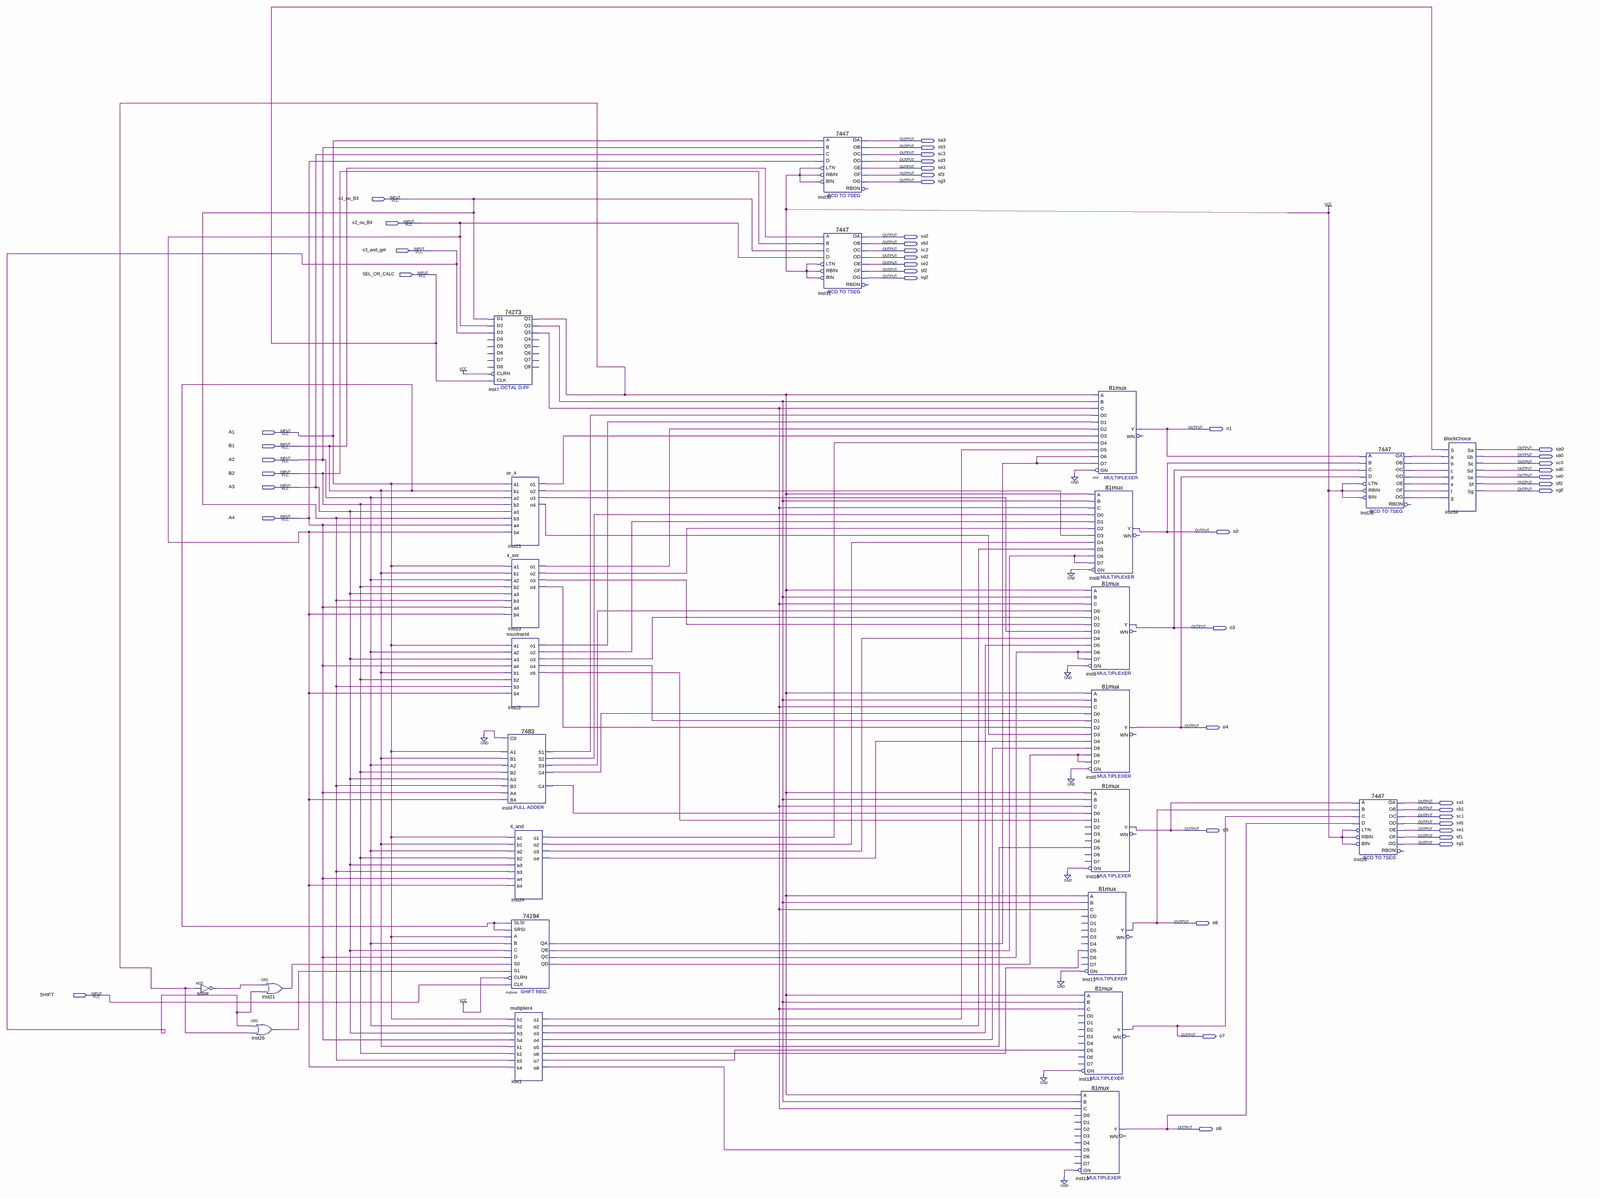
[diagram p0: schematic sheet, whole]
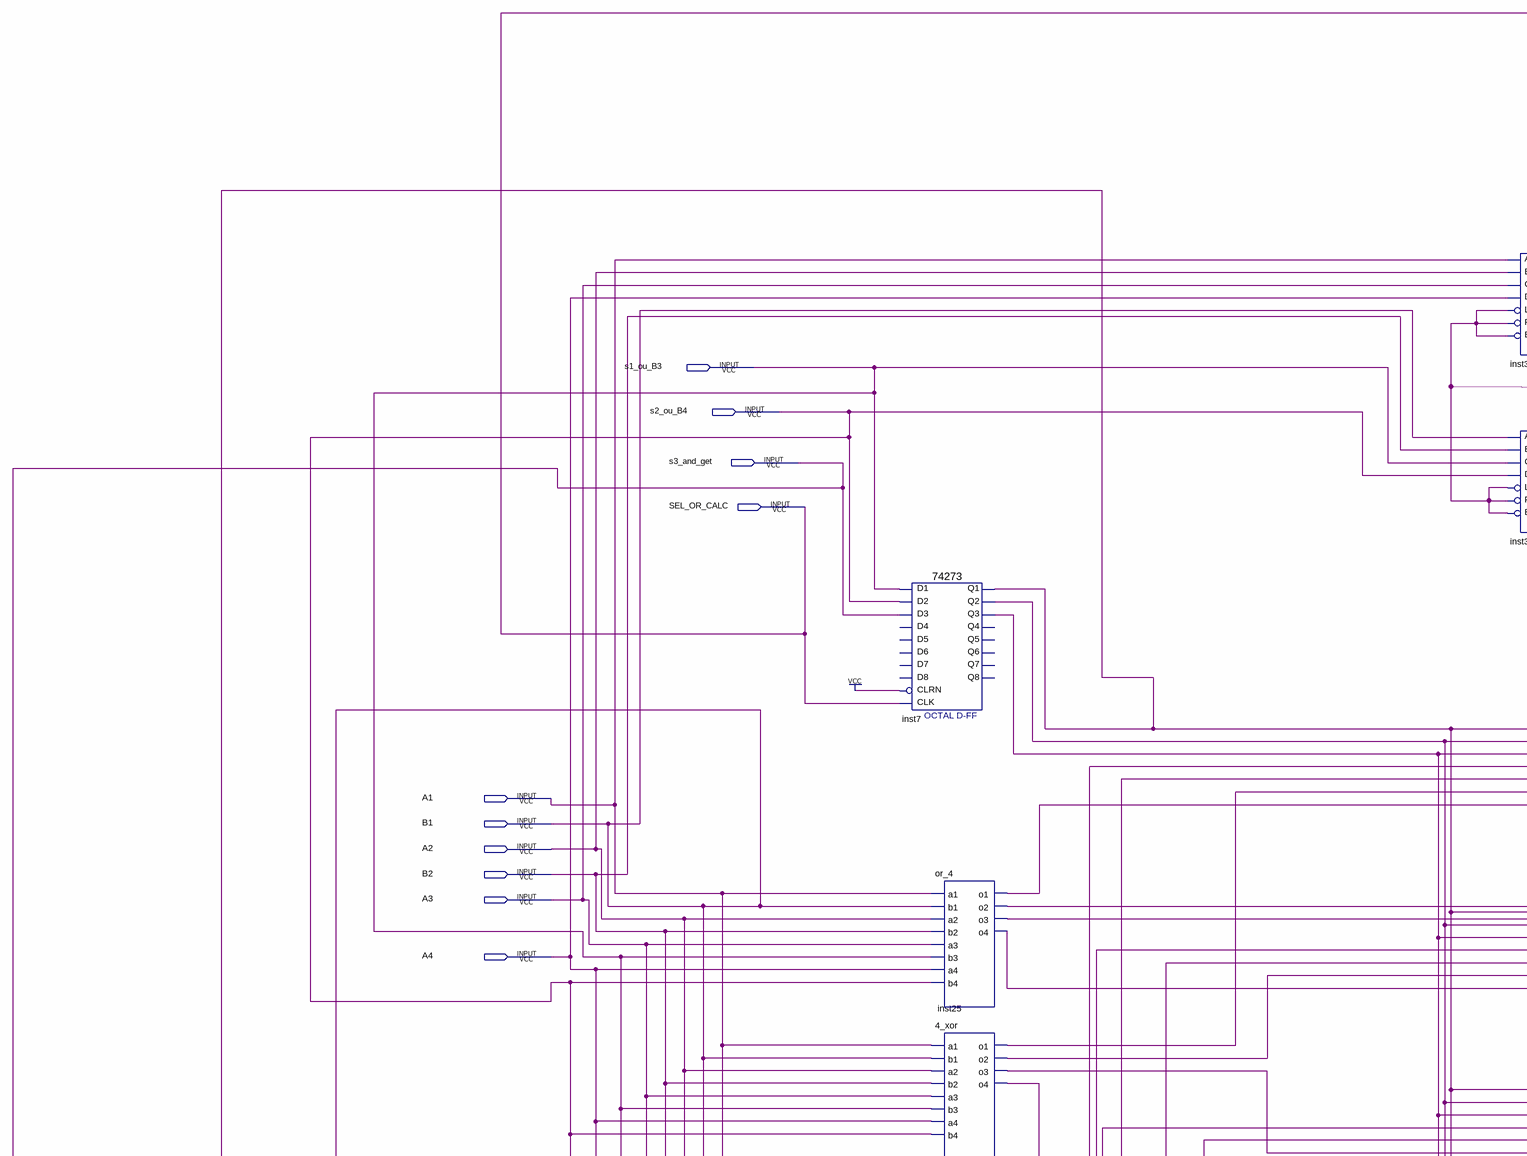
[diagram p1: schematic sheet, upper left part]
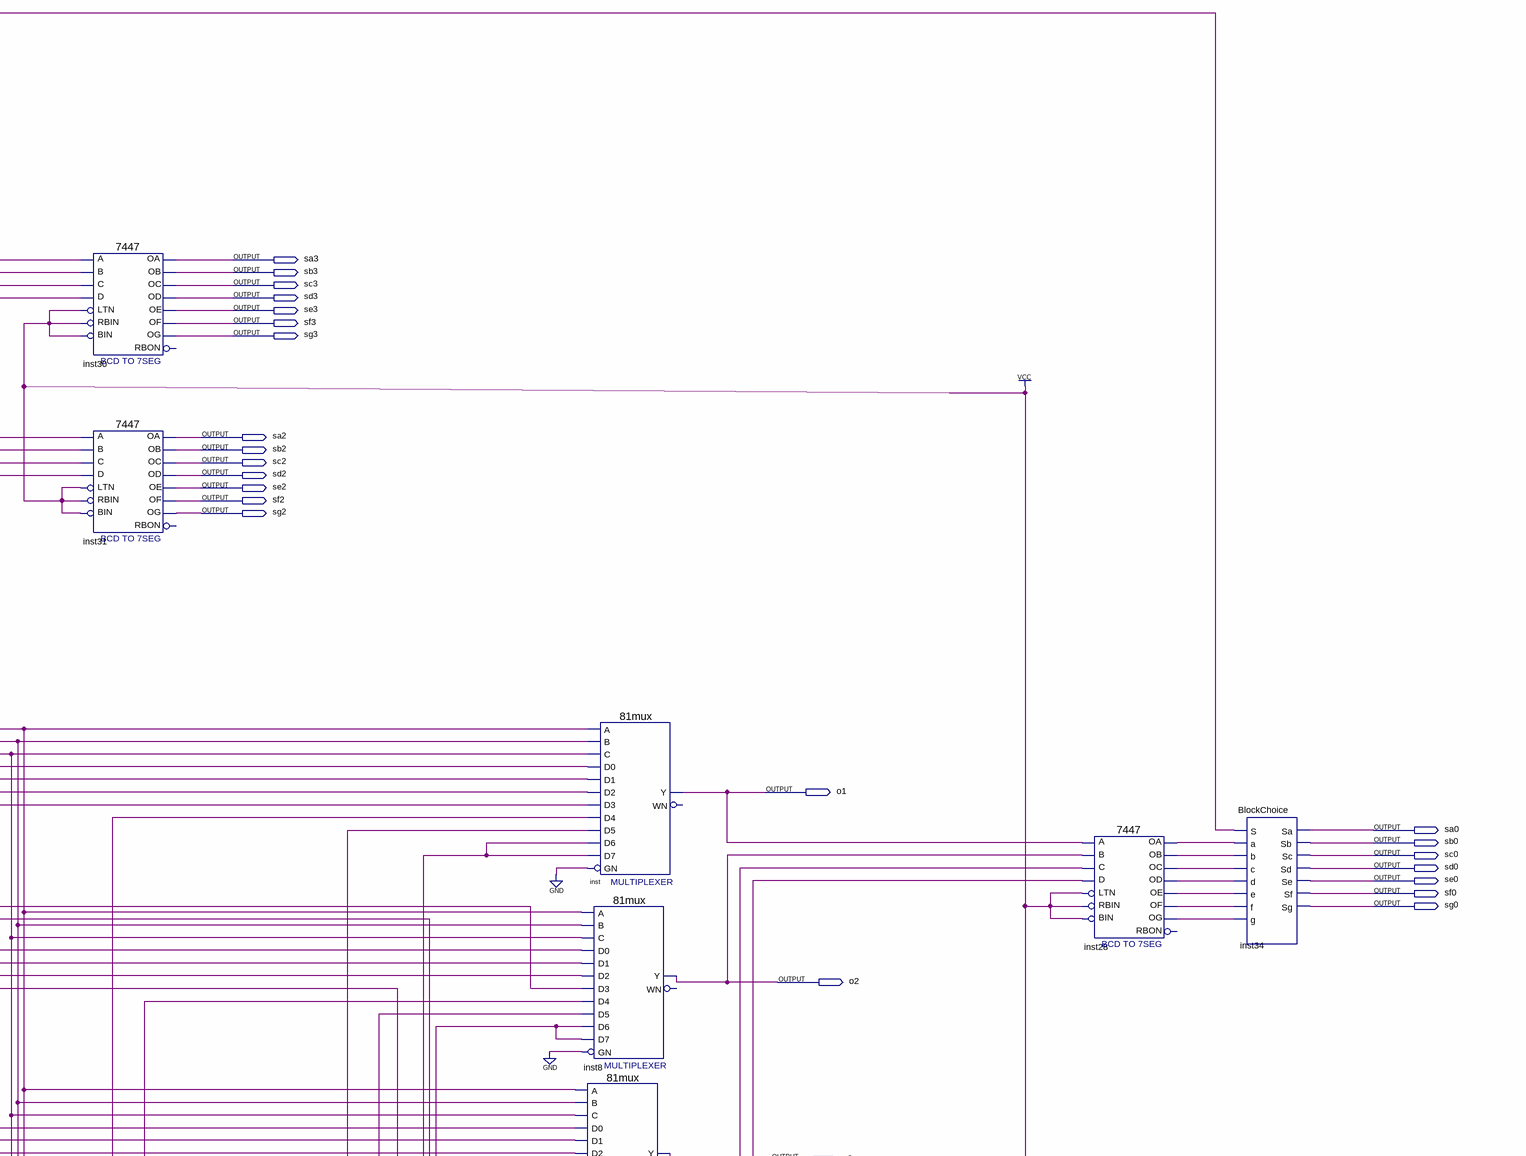
[diagram p2: schematic sheet, upper right part]
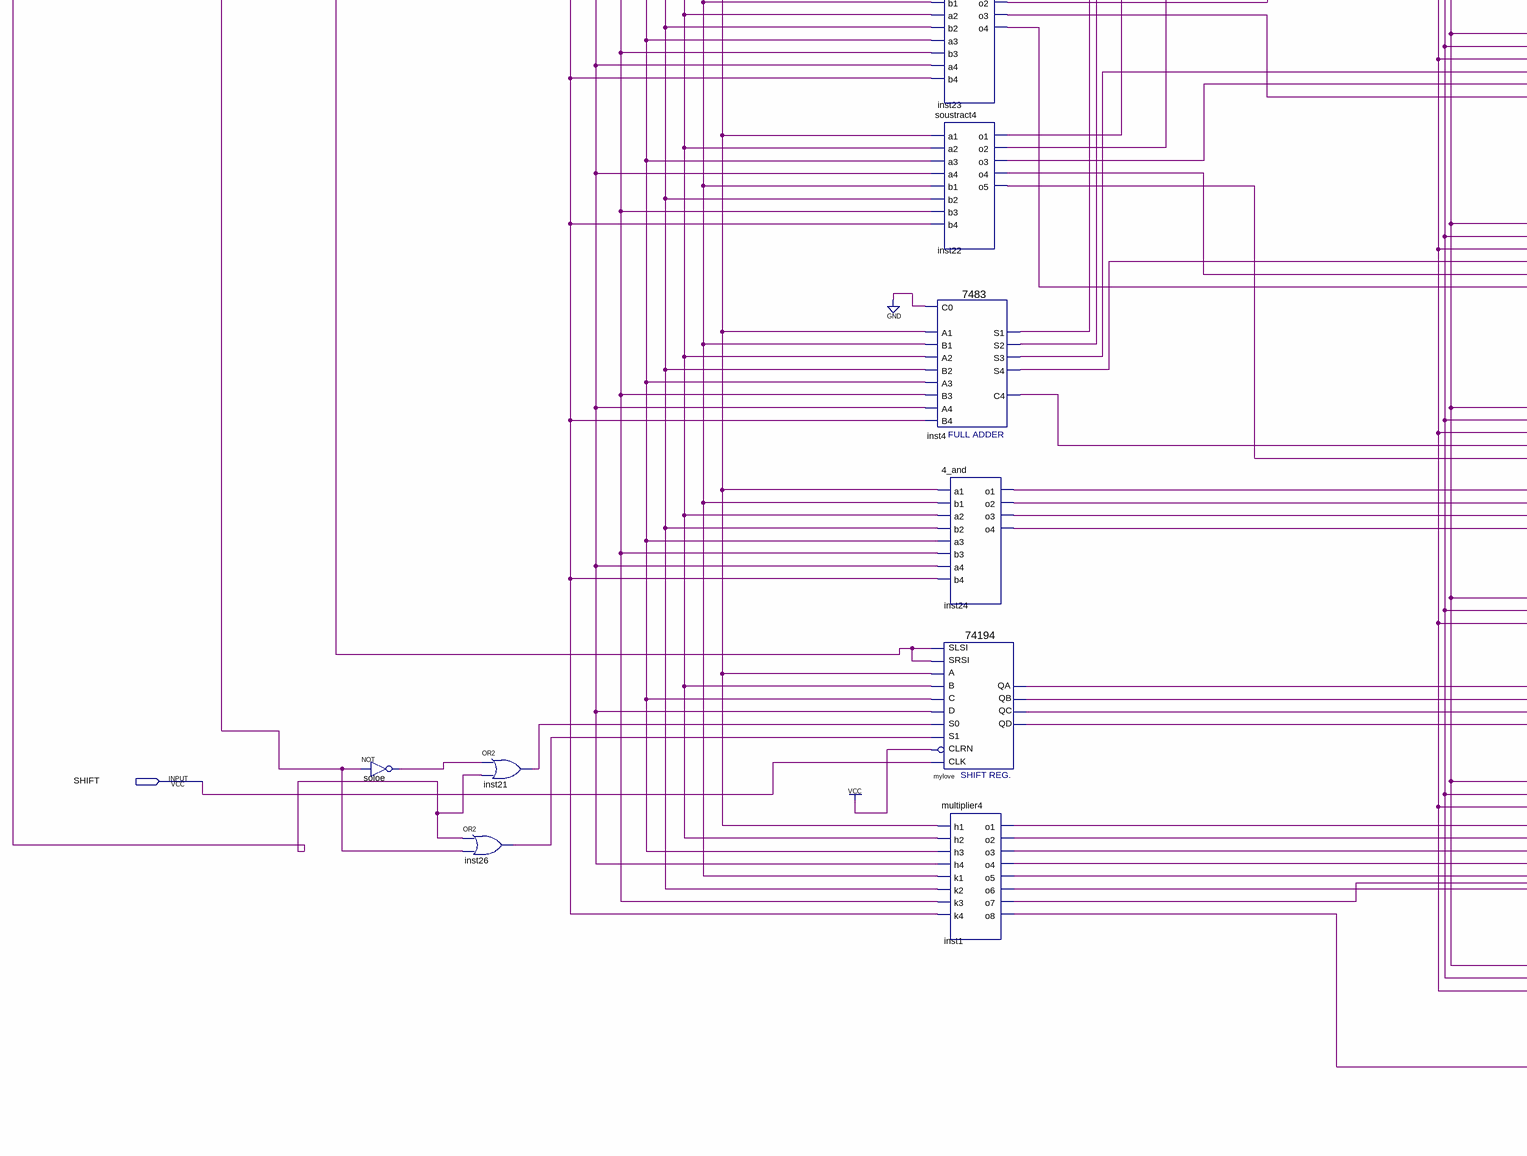
[diagram p3: schematic sheet, lower left part]
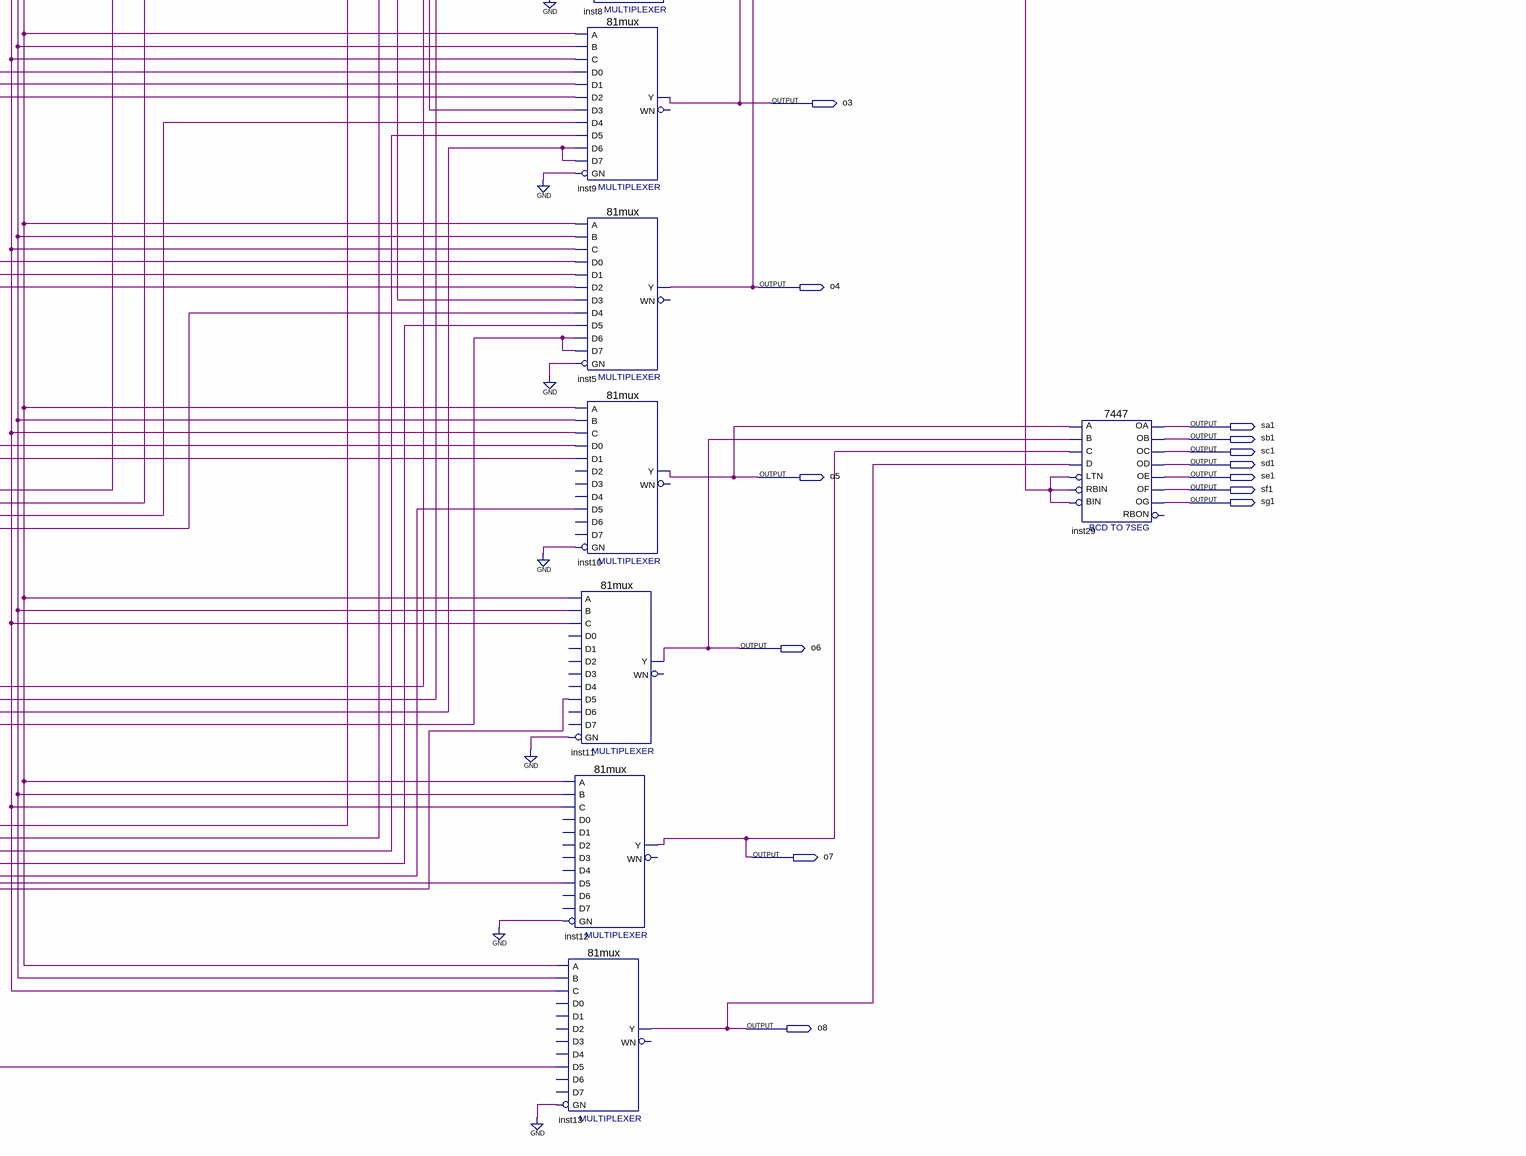
[diagram p4: schematic sheet, lower right part]
// Quartus schematic unitarithlogic.bdf as structural Verilog: 24 symbols, 47 pins
module unitarithlogic (
  input  s1_ou_B3,
  input  s2_ou_B4,
  input  s3_and_get,
  input  SEL_OR_CALC,
  input  A1,
  input  B1,
  input  A2,
  input  B2,
  input  A3,
  input  A4,
  input  SHIFT,
  output sa3,
  output sb3,
  output sc3,
  output sd3,
  output se3,
  output sf3,
  output sg3,
  output sa2,
  output sb2,
  output sc2,
  output sd2,
  output se2,
  output sf2,
  output sg2,
  output o1,
  output sa0,
  output sb0,
  output sc0,
  output sd0,
  output se0,
  output sf0,
  output sg0,
  output o2,
  output o3,
  output o4,
  output sa1,
  output sb1,
  output sc1,
  output sd1,
  output o5,
  output se1,
  output sf1,
  output sg1,
  output o6,
  output o7,
  output o8
);

  wire inst1_o1, inst1_o2, inst1_o3, inst1_o4, inst1_o5, inst1_o6, inst1_o7, inst1_o8, inst4_c4, inst4_s1,
       inst4_s2, inst4_s3, inst4_s4, inst7_q1, inst7_q2, inst7_q3, inst21_out, inst22_o1, inst22_o2,
       inst22_o3, inst22_o4, inst22_o5, inst23_o1, inst23_o2, inst23_o3, inst23_o4, inst24_o1, inst24_o2,
       inst24_o3, inst24_o4, inst25_o1, inst25_o2, inst25_o3, inst25_o4, inst26_out, inst28_oa, inst28_ob,
       inst28_oc, inst28_od, inst28_oe, inst28_of, inst28_og, mylove_qa, mylove_qb, mylove_qc, mylove_qd,
       soloe_out;

  not soloe (soloe_out, inst7_q1);
  or inst26 (inst26_out, s3_and_get, inst7_q1);
  or inst21 (inst21_out, soloe_out, s3_and_get);
  \74273  inst7 (
    .D2(s2_ou_B4), .D3(s3_and_get), .D1(s1_ou_B3), .CLK(SEL_OR_CALC), .CLRN(1'b1), .Q1(inst7_q1),
    .Q2(inst7_q2), .Q3(inst7_q3));  // open: D4, D7, D6, D5, D8, Q4, Q6, Q5, Q7, Q8
  or_4 inst25 (
    .a1(A1), .b1(B1), .a2(A2), .b2(B2), .a3(A3), .b3(s1_ou_B3), .a4(A4), .b4(s2_ou_B4), .o1(inst25_o1),
    .o2(inst25_o2), .o3(inst25_o3), .o4(inst25_o4));
  \4_xor  inst23 (
    .a1(A1), .b1(B1), .a2(A2), .b2(B2), .a3(A3), .b3(s1_ou_B3), .a4(A4), .b4(s2_ou_B4), .o1(inst23_o1),
    .o2(inst23_o2), .o3(inst23_o3), .o4(inst23_o4));
  soustract4 inst22 (
    .a1(A1), .a2(A2), .a3(A3), .a4(A4), .b1(B1), .b2(B2), .b3(s1_ou_B3), .b4(s2_ou_B4), .o1(inst22_o1),
    .o2(inst22_o2), .o3(inst22_o3), .o4(inst22_o4), .o5(inst22_o5));
  \7483  inst4 (
    .B4(s2_ou_B4), .C0(1'b0), .A1(A1), .A2(A2), .B1(B1), .B2(B2), .A3(A3), .B3(s1_ou_B3), .A4(A4),
    .S3(inst4_s3), .S4(inst4_s4), .S2(inst4_s2), .C4(inst4_c4), .S1(inst4_s1));
  \74194  mylove (
    .SLSI(B1), .SRSI(B1), .B(A2), .C(A3), .CLK(SHIFT), .CLRN(1'b1), .D(A4), .S1(inst26_out), .S0(inst21_out),
    .A(A1), .QA(mylove_qa), .QB(mylove_qb), .QC(mylove_qc), .QD(mylove_qd));
  \4_and  inst24 (
    .a1(A1), .b1(B1), .a2(A2), .b2(B2), .a3(A3), .b3(s1_ou_B3), .a4(A4), .b4(s2_ou_B4), .o1(inst24_o1),
    .o2(inst24_o2), .o3(inst24_o3), .o4(inst24_o4));
  multiplier4 inst1 (
    .h1(A1), .h2(A2), .h3(A3), .h4(A4), .k1(B1), .k2(B2), .k3(s1_ou_B3), .k4(s2_ou_B4), .o1(inst1_o1),
    .o2(inst1_o2), .o3(inst1_o3), .o4(inst1_o4), .o5(inst1_o5), .o6(inst1_o6), .o7(inst1_o7), .o8(inst1_o8));
  \7447  inst30 (
    .LTN(1'b1), .B(A2), .C(A3), .D(A4), .RBIN(1'b1), .BIN(1'b1), .A(A1), .OB(sb3), .OC(sc3), .OE(se3),
    .OD(sd3), .OF(sf3), .OG(sg3), .OA(sa3));  // open: RBON
  \7447  inst31 (
    .LTN(1'b1), .B(B2), .C(s1_ou_B3), .D(s2_ou_B4), .RBIN(1'b1), .BIN(1'b1), .A(B1), .OB(sb2), .OC(sc2),
    .OE(se2), .OD(sd2), .OF(sf2), .OG(sg2), .OA(sa2));  // open: RBON
  \81mux  inst11 (
    .C(inst7_q3), .D5(inst1_o6), .GN(1'b0), .A(inst7_q1), .B(inst7_q2), .Y(o6));  // open: D1, D0, D4, D2, D3, D7, D6, WN
  \81mux  inst12 (
    .C(inst7_q3), .D5(inst1_o7), .GN(1'b0), .A(inst7_q1), .B(inst7_q2), .Y(o7));  // open: D1, D0, D4, D2, D3, D7, D6, WN
  \81mux  inst13 (
    .C(inst7_q3), .D5(inst1_o8), .GN(1'b0), .A(inst7_q1), .B(inst7_q2), .Y(o8));  // open: D1, D0, D4, D2, D3, D7, D6, WN
  \81mux  inst (
    .C(inst7_q3), .D1(inst22_o1), .D0(inst4_s1), .D5(inst1_o1), .D4(inst24_o1), .D2(inst23_o1),
    .D3(inst25_o1), .GN(1'b0), .D7(mylove_qa), .D6(mylove_qa), .A(inst7_q1), .B(inst7_q2), .Y(o1));  // open: WN
  \81mux  inst8 (
    .C(inst7_q3), .D1(inst22_o2), .D0(inst4_s2), .D5(inst1_o2), .D4(inst24_o2), .D2(inst23_o2),
    .D3(inst25_o2), .GN(1'b0), .D7(mylove_qb), .D6(mylove_qb), .A(inst7_q1), .B(inst7_q2), .Y(o2));  // open: WN
  \81mux  inst9 (
    .C(inst7_q3), .D1(inst22_o3), .D0(inst4_s3), .D5(inst1_o3), .D4(inst24_o3), .D2(inst23_o3),
    .D3(inst25_o3), .GN(1'b0), .D7(mylove_qc), .D6(mylove_qc), .A(inst7_q1), .B(inst7_q2), .Y(o3));  // open: WN
  \81mux  inst5 (
    .C(inst7_q3), .D1(inst22_o4), .D0(inst4_s4), .D5(inst1_o4), .D4(inst24_o4), .D2(inst23_o4),
    .D3(inst25_o4), .GN(1'b0), .D7(mylove_qd), .D6(mylove_qd), .A(inst7_q1), .B(inst7_q2), .Y(o4));  // open: WN
  \81mux  inst10 (
    .C(inst7_q3), .D1(inst22_o5), .D0(inst4_c4), .D5(inst1_o5), .GN(1'b0), .A(inst7_q1), .B(inst7_q2), .Y(o5));  // open: D4, D2, D3, D7, D6, WN
  \7447  inst29 (
    .LTN(1'b1), .B(o6), .C(o7), .D(o8), .RBIN(1'b1), .BIN(1'b1), .A(o5), .OB(sb1), .OC(sc1), .OE(se1),
    .OD(sd1), .OF(sf1), .OG(sg1), .OA(sa1));  // open: RBON
  \7447  inst28 (
    .LTN(1'b1), .B(o2), .C(o3), .D(o4), .RBIN(1'b1), .BIN(1'b1), .A(o1), .OB(inst28_ob), .OC(inst28_oc),
    .OE(inst28_oe), .OD(inst28_od), .OF(inst28_of), .OG(inst28_og), .OA(inst28_oa));  // open: RBON
  BlockChoice inst34 (
    .S(SEL_OR_CALC), .a(inst28_oa), .b(inst28_ob), .c(inst28_oc), .d(inst28_od), .e(inst28_oe),
    .f(inst28_of), .g(inst28_og), .Sa(sa0), .Sb(sb0), .Sc(sc0), .Sd(sd0), .Se(se0), .Sf(sf0), .Sg(sg0));
endmodule
